# Altium schematic sheet comparator.SchDoc
size A
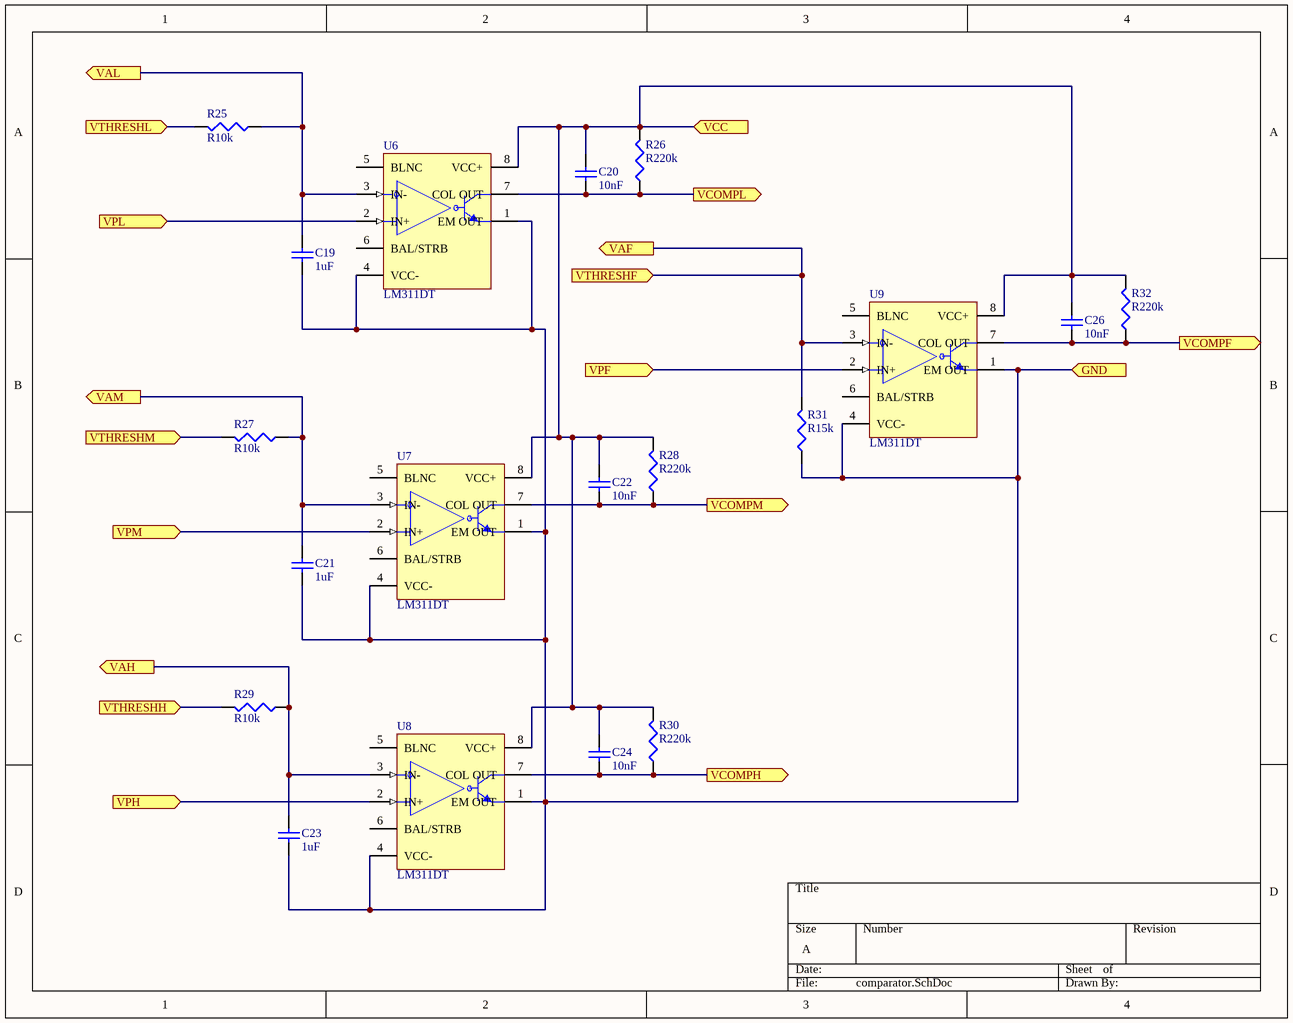
[diagram p0: comparator.SchDoc]

## Parts
C19  1uF  [C0603]
C20  10nF  [C0603]
C21  1uF  [C0603]
C22  10nF  [C0603]
C23  1uF  [C0603]
C24  10nF  [C0603]
C26  10nF  [C0603]
R25  R10k  [R0603]
R26  R220k  [R0603]
R27  R10k  [R0603]
R28  R220k  [R0603]
R29  R10k  [R0603]
R30  R220k  [R0603]
R31  R15k  [R0603]
R32  R220k  [R0603]
U6  LM311DT  [soic8]
U7  LM311DT  [soic8]
U8  LM311DT  [soic8]
U9  LM311DT  [soic8]

## Ports
GND (in), VAF (out), VAH (out), VAL (out), VAM (out), VCC (in), VCOMPF (out), VCOMPH (out), VCOMPL (out), VCOMPM (out), VPF (in), VPH (in), VPL (in), VPM (in), VTHRESHF (in), VTHRESHH (in), VTHRESHL (in), VTHRESHM (in)

## Nets
GND: C19.2 C21.2 C23.2 R31.1 U6.1(EM_OUT) U6.4(VCC-) U7.1(EM_OUT) U7.4(VCC-) U8.1(EM_OUT) U8.4(VCC-) U9.1(EM_OUT) U9.4(VCC-) ; port GND
VAF: R31.2 U9.3(IN-) ; port VTHRESHF, port VAF
VAH: C23.1 R29.1 U8.3(IN-) ; port VAH
VAL: C19.1 R25.1 U6.3(IN-) ; port VAL
VAM: C21.1 R27.1 U7.3(IN-) ; port VAM
VCC: C20.1 C22.1 C24.1 C26.1 R26.2 R28.2 R30.2 R32.2 U6.8(VCC+) U7.8(VCC+) U8.8(VCC+) U9.8(VCC+) ; port VCC
VCOMPF: C26.2 R32.1 U9.7(COL_OUT) ; port VCOMPF
VCOMPH: C24.2 R30.1 U8.7(COL_OUT) ; port VCOMPH
VCOMPL: C20.2 R26.1 U6.7(COL_OUT) ; port VCOMPL
VCOMPM: C22.2 R28.1 U7.7(COL_OUT) ; port VCOMPM
VPF: U9.2(IN+) ; port VPF
VPH: U8.2(IN+) ; port VPH
VPL: U6.2(IN+) ; port VPL
VPM: U7.2(IN+) ; port VPM
VTHRESHH: R29.2 ; port VTHRESHH
VTHRESHL: R25.2 ; port VTHRESHL
VTHRESHM: R27.2 ; port VTHRESHM

Not connected (* = marked no-connect by the designer): U6 5(BLNC) 6(BAL/STRB); U7 5(BLNC) 6(BAL/STRB); U8 5(BLNC) 6(BAL/STRB); U9 5(BLNC) 6(BAL/STRB)

## Library data of the parts
C19 C21 C23 = C1uF: 1 uF Surface Mount Capacitor; Manufacturer: Murata Electronics North America; Manufacturer Part Number: GRM188R61C105KA93D; Capacitance: 1µF; Tolerance: ±10%; Voltage - Rated: 16V; Temperature Coefficient: X5R; Supplier 1: Digi-Key; RoHS: RoHS Compliant; Category: Capacitors; Stock 1: 1349645; Pricing 1: 1=0.1, 10=0.034, 50=0.0182, 100=0.0154, 250=0.0126, 500=0.01078, 1000=0.0084 (USD); Packaging: Digi-Reel®; Part Status: Active; Operating Temperature: -55°C ~ 85°C; Features: -; Ratings: -; Applications: General Purpose; Mounting Type: Surface Mount, MLCC; Package / Case: 0603 (1608 Metric); Size / Dimension: 0.063" L x 0.031" W (1.60mm x 0.80mm); Height - Seated (Max): -; Thickness (Max): 0.035" (0.90mm); Lead Spacing: -; Lead Style: -; ComponentLink1URL: http://www.murata.com/~/media/webrenewal/support/library/catalog/products/capacitor/mlcc/c02e.pdf; ComponentLink1Description: http://www.murata.com/~/media/webrenewal/support/library/catalog/products/capacitor/mlcc/c02e.pdf; Supplier Part Number 1: 490-1536-6-ND
C20 C22 C24 C26 = C10nF: 10 nF Surface Mount Capacitor; Manufacturer: Murata Electronics North America; Manufacturer Part Number: GRM188R70J103KA01D; Capacitance: 10000pF; Tolerance: ±10%; Voltage - Rated: 6.3V; Temperature Coefficient: X7R; Supplier 1: Digi-Key; RoHS: RoHS Compliant; Category: Capacitors; Stock 1: 37902; Pricing 1: 1=0.1, 10=0.049, 50=0.0266, 100=0.0226, 250=0.01844, 500=0.01578, 1000=0.0123 (USD); Packaging: Digi-Reel®; Part Status: Active; Operating Temperature: -55°C ~ 125°C; Features: -; Ratings: -; Applications: General Purpose; Mounting Type: Surface Mount, MLCC; Package / Case: 0603 (1608 Metric); Size / Dimension: 0.063" L x 0.031" W (1.60mm x 0.80mm); Height - Seated (Max): -; Thickness (Max): 0.035" (0.90mm); Lead Spacing: -; Lead Style: -; ComponentLink1URL: http://www.murata.com/~/media/webrenewal/support/library/catalog/products/capacitor/mlcc/c02e.pdf; ComponentLink1Description: http://www.murata.com/~/media/webrenewal/support/library/catalog/products/capacitor/mlcc/c02e.pdf; Supplier Part Number 1: 490-9729-6-ND
R25 R27 R29 = R10k: 10k Ohms Surface Mount Resistor; Manufacturer: Yageo; Manufacturer Part Number: RC0603FR-0710KL; Tolerance: ±1%; Power (Watts): 0.1W, 1/10W; Temperature Coefficient: ±100ppm/°C; Supplier 1: Digi-Key; RoHS: RoHS Compliant; Category: Resistors; Stock 1: 15519632; Pricing 1: 1=0.1, 10=0.013, 25=0.0092, 50=0.007, 100=0.0052, 250=0.00396, 500=0.00316, 1000=0.00233 (USD); Packaging: Digi-Reel®; Part Status: Active; Resistance (Ohms): 10k; Composition: Thick Film; Features: Moisture Resistant; Operating Temperature: -55°C ~ 155°C; Package / Case: 0603 (1608 Metric); Supplier Device Package: 0603; Size / Dimension: 0.063" L x 0.031" W (1.60mm x 0.80mm); Height - Seated (Max): 0.022" (0.55mm); Number of Terminations: 2; Failure Rate: -; ComponentLink1URL: http://www.yageo.com/NewPortal/yageodocoutput?fileName=/pdf/R-Chip/PYu-RC_Group_51_RoHS_L_4.pdf; ComponentLink1Description: http://www.yageo.com/NewPortal/yageodocoutput?fileName=/pdf/R-Chip/PYu-RC_Group_51_RoHS_L_4.pdf; Supplier Part Number 1: 311-10.0KHRDKR-ND
R26 R28 R30 R32 = R220k: 220k Ohms Surface Mount Resistor; Manufacturer: Yageo; Manufacturer Part Number: RC0603FR-07220KL; Tolerance: ±1%; Power (Watts): 0.1W, 1/10W; Temperature Coefficient: ±100ppm/°C; Supplier 1: Digi-Key; RoHS: RoHS Compliant; Category: Resistors; Stock 1: 712768; Pricing 1: 1=0.1, 10=0.013, 25=0.0092, 50=0.007, 100=0.0052, 250=0.00396, 500=0.00316, 1000=0.00233 (USD); Packaging: Digi-Reel®; Part Status: Active; Resistance (Ohms): 220k; Composition: Thick Film; Features: Moisture Resistant; Operating Temperature: -55°C ~ 155°C; Package / Case: 0603 (1608 Metric); Supplier Device Package: 0603; Size / Dimension: 0.063" L x 0.031" W (1.60mm x 0.80mm); Height - Seated (Max): 0.022" (0.55mm); Number of Terminations: 2; Failure Rate: -; ComponentLink1URL: http://www.yageo.com/NewPortal/yageodocoutput?fileName=/pdf/R-Chip/PYu-RC_Group_51_RoHS_L_4.pdf; ComponentLink1Description: http://www.yageo.com/NewPortal/yageodocoutput?fileName=/pdf/R-Chip/PYu-RC_Group_51_RoHS_L_4.pdf; Supplier Part Number 1: 311-220KHRDKR-ND
R31 = R15k: 15k Ohms Surface Mount Resistor; Manufacturer: Yageo; Manufacturer Part Number: RC0603FR-0715KL; Tolerance: ±1%; Power (Watts): 0.1W, 1/10W; Temperature Coefficient: ±100ppm/°C; Supplier 1: Digi-Key; RoHS: RoHS Compliant; Category: Resistors; Stock 1: 489455; Pricing 1: 1=0.1, 10=0.013, 25=0.0092, 50=0.007, 100=0.0052, 250=0.00396, 500=0.00316, 1000=0.00233 (USD); Packaging: Digi-Reel®; Part Status: Active; Resistance (Ohms): 15k; Composition: Thick Film; Features: Moisture Resistant; Operating Temperature: -55°C ~ 155°C; Package / Case: 0603 (1608 Metric); Supplier Device Package: 0603; Size / Dimension: 0.063" L x 0.031" W (1.60mm x 0.80mm); Height - Seated (Max): 0.022" (0.55mm); Number of Terminations: 2; Failure Rate: -; ComponentLink1URL: http://www.yageo.com/NewPortal/yageodocoutput?fileName=/pdf/R-Chip/PYu-RC_Group_51_RoHS_L_4.pdf; ComponentLink1Description: http://www.yageo.com/NewPortal/yageodocoutput?fileName=/pdf/R-Chip/PYu-RC_Group_51_RoHS_L_4.pdf; Supplier Part Number 1: 311-15.0KHRDKR-ND
U6-U9 = LM311DT: IC Comparator; Manufacturer: STMicroelectronics; Number of Elements: 1; Output Type: DTL, MOS, Open-Collector, Open-Emitter, RTL, TTL; Voltage - Supply, Single/Dual (±): 5 V ~ 30 V, ±2.5 V ~ 15 V; Voltage - Input Offset (Max): 7.5mV @ ±15V; Current - Input Bias (Max): 0.25µA @ ±15V; Current - Output (Typ): 50mA; Current - Quiescent (Max): 7.5mA; Supplier 1: Digi-Key; Manufacturer Part Number: LM311DT; RoHS: RoHS Compliant; Category: Integrated Circuits (ICs); Stock 1: 9481; Pricing 1: 1=0.39, 10=0.315, 100=0.2142, 500=0.16068, 1000=0.12051 (USD); Packaging: Cut Tape (CT); Part Status: Active; Type: General Purpose; CMRR, PSRR (Typ): -; Propagation Delay (Max): -; Hysteresis: -; Operating Temperature: 0°C ~ 70°C; Package / Case: 8-SOIC (0.154", 3.90mm Width); Mounting Type: Surface Mount; Supplier Device Package: 8-SO; ComponentLink1URL: http://www.st.com/content/ccc/resource/technical/document/datasheet/2d/22/50/0e/7e/39/43/64/CD00001072.pdf/files/CD00001072.pdf/jcr:content/translations/en.CD00001072.pdf; ComponentLink1Description: http://www.st.com/content/ccc/resource/technical/document/datasheet/2d/22/50/0e/7e/39/43/64/CD00001072.pdf/files/CD00001072.pdf/jcr:content/translations/en.CD00001072.pdf; Supplier Part Number 1: 497-1569-1-ND